# Altium schematic sheet InputDriver.SchDoc
size A4
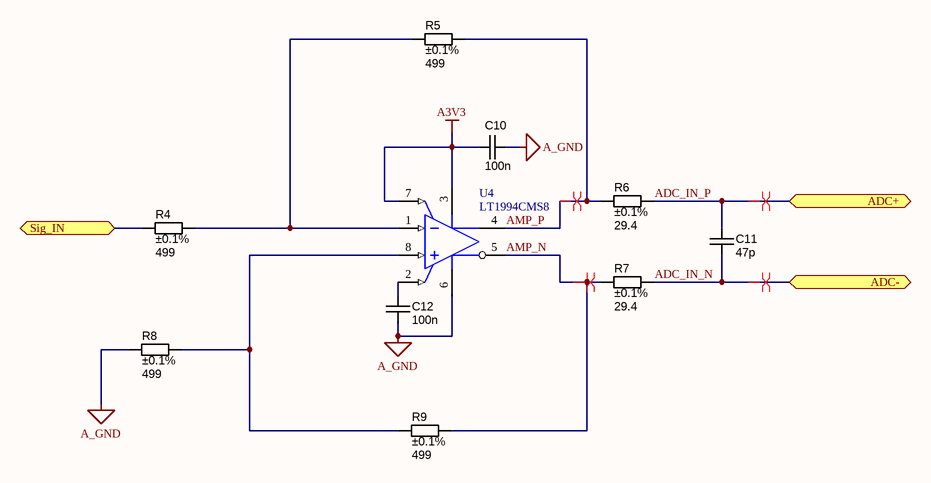
[diagram p0: InputDriver.SchDoc]

## Parts
C10  100n  [CAPC2012X135N]
C11  47p  [CAPC2012X135N]
C12  100n  [CAPC2012X135N]
R4  value 499  Tolerance: ±0.1%  [RESC2012X70N]  (hidden comment: Thick Film)
R5  value 499  Tolerance: ±0.1%  [RESC2012X70N]  (hidden comment: Thick Film)
R6  value 29.4  Tolerance: ±0.1%  [RESC2012X70N]  (hidden comment: Thick Film)
R7  value 29.4  Tolerance: ±0.1%  [RESC2012X70N]  (hidden comment: Thick Film)
R8  value 499  Tolerance: ±0.1%  [RESC2012X70N]  (hidden comment: Thick Film)
R9  value 499  Tolerance: ±0.1%  [RESC2012X70N]  (hidden comment: Thick Film)
U4  LT1994CMS8  [LT-MS8-8_N]

## Ports
ADC+, ADC-, Sig_IN

## Nets
A3V3: C10.1 U4.3(V+) U4.7(~{SHDN})
A_GND: C10.2 C12.2 R8.1 U4.6(V-)
ADC_IN_N: C11.2 R7.2 ; port ADC-
ADC_IN_P: C11.1 R6.2 ; port ADC+
AMP_N: R7.1 R9.2 U4.5(OUT-)
AMP_P: R5.2 R6.1 U4.4(OUT+)
Sig_IN: R4.1 ; port Sig_IN
NetC12_1: C12.1 U4.2(VOCM)
NetR4_2: R4.2 R5.1 U4.1(IN-)
NetR8_2: R8.2 R9.1 U4.8(IN+)

## Layout directives
differential pair: ADC_IN_N, ADC_IN_P, AMP_N, AMP_P

## Library data of the parts
C10 C12 = CAPC_100n_0402_X5R_16V_10%: Capacitor SMD Cer 100nF 10% 16V X5R 0402; Manufacturer 1: AVX Corporation; Manufacturer Part Number 1: 0402YD104KAT2A; Ratings: 16V; X5R; SCDType: spec; Tolerance: ±10%; Operating Temperature: -55°C ~ 125°C; Package / Case: 0402 (1005 Metric); Size / Dimension: 0.039" L x 0.020" W (1.00mm x 0.50mm); Supplier 1: Digi-Key; Supplier Part Number 1: 478-1126-1-ND; ComponentLink1URL: http://www.avx.com/docs/Catalogs/cx5r.pdf; ComponentLink1Description: http://www.avx.com/docs/Catalogs/cx5r.pdf; Supplier 2: Digi-Key; Supplier Part Number 2: 311-1347-1-ND; Manufacturer 2: Yageo; Manufacturer Part Number 2: CC0402KRX5R7BB104; ComponentLink2URL: http://www.yageo.com/documents/recent/UPY-GPHC_X5R_4V-to-50V_12.pdf; ComponentLink2Description: http://www.yageo.com/documents/recent/UPY-GPHC_X5R_4V-to-50V_12.pdf; Value: 100n
C11 = CAPC_39p_0603_NP0_50V_1%: Capacitor SMD Cer 39pF 1% 50V NP0 0603; Manufacturer 1: AVX Corporation; Manufacturer Part Number 1: 06035A390FAT; Ratings: 50V; NP0; SCDType: source; Temperature Coefficient: C0G, NP0; Tolerance: ±1%; Operating Temperature: -55°C ~ 125°C; Package / Case: 0603 (1608 Metric); Supplier 1: Digi-Key; Supplier Part Number 1: 478-7918-6-ND; RoHS 1: RoHS Compliant; ComponentLink1URL: http://www.avx.com/docs/Catalogs/ccog.pdf; ComponentLink1Description: http://www.avx.com/docs/Catalogs/ccog.pdf; Supplier 2: Digi-Key; Supplier Part Number 2: 399-7909-6-ND; Manufacturer 2: Kemet; Manufacturer Part Number 2: C0603C390F5GACTU; RoHS 2: RoHS Compliant; ComponentLink2URL: http://www.kemet.com/datasheets&C0603C390F5GACTU; ComponentLink2Description: http://www.kemet.com/datasheets&C0603C390F5GACTU; Supplier 3: Digi-Key; Supplier Part Number 3: GRM1885C1H390FA01D-ND; Manufacturer 3: Murata Electronics North America; Manufacturer Part Number 3: GRM1885C1H390FA01; RoHS 3: RoHS Compliant; ComponentLink3URL: http://search.murata.co.jp/Ceramy/image/img/A01X/G101/ENG/GRM1885C1H390FA01-01.pdf; ComponentLink3Description: http://search.murata.co.jp/Ceramy/image/img/A01X/G101/ENG/GRM1885C1H390FA01-01.pdf; Value: 47p
R4-R9 = RES_1K_0805_1%: Resistor SMD chip 1k Ohm 0.125W 1% 0805; Manufacturer 1: Vishay/Dale; Manufacturer Part Number 1: CRCW08051K00FKEA; Ratings: 1/8W; SCDType: spec; Supplier 1: Digi-Key; Supplier Part Number 1: 541-1.00KCCT-ND; Package / Case: 0805 (2012 metric)
U4 = LT1994CMS8: Single Channel, Low Noise, Low Distortion Fully Differential Input / Output Amplifier / Driver, 70 MHz Typical GBW, 65 V/us Typical SR, 2.375 to 12.6 V, 8-Pin SOP (MS8-8), Commercial; Linear Technology Part Number: LT1994; Manufacturer: Linear Technology; Channels (#): 1; GBW (MHz) Typical: 70; Is (mA) Typical: 13.3; SR (V/us) Typical: 65; Vos (mV) Guaranteed: 2; Vs Max (V): 12.6; Vs Min (V): 2.375; DatasheetVersion: Rev. B; PackageVersion: Rev G; PackageReference: LT-MS8-8; PackageDescription: 8-Lead Plastic Small Outline, Body 3.9 x 4.9 mm, Pitch 1.27 mm; Type: DIFF; Vos (mV) Typical: 2; Mounting Technology: Surface Mount; PartNumber: LT1994CMS8; ComponentLink1Description: Manufacturer URL; ComponentLink1URL: http://www.linear.com/; ComponentLink2Description: Datasheet; ComponentLink2URL: http://cds.linear.com/docs/en/datasheet/1994fb.pdf; ComponentLink3Description: Package Specification; ComponentLink3URL: http://cds.linear.com/docs/en/packaging/05081610_G_SO8.pdf